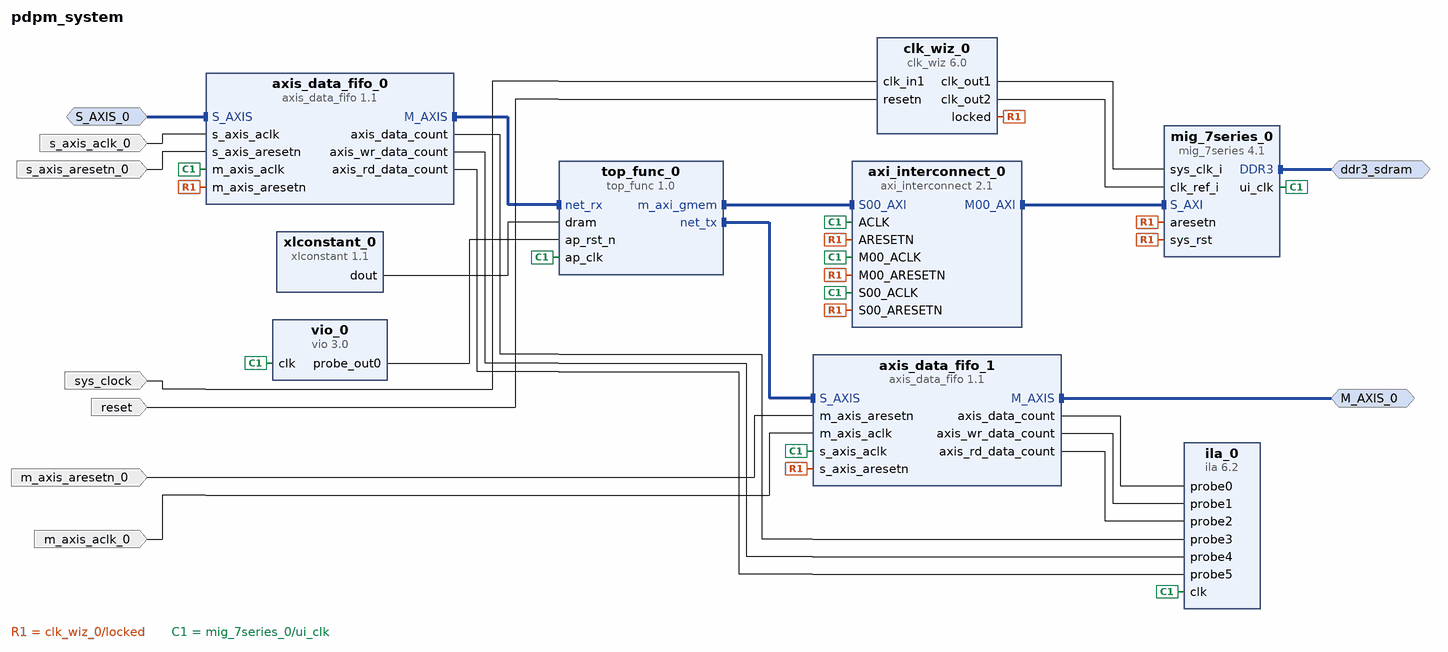
[diagram p0: block diagram of the top level]
# Vivado block design pdpm_system, xc7a100tcsg324-1, Vivado 2018.2.2
create_bd_design pdpm_system

create_bd_intf_port -mode Master -vlnv xilinx.com:interface:ddrx_rtl:1.0 ddr3_sdram
create_bd_intf_port -mode Master -vlnv xilinx.com:interface:axis_rtl:1.0 M_AXIS_0
create_bd_intf_port -mode Slave -vlnv xilinx.com:interface:axis_rtl:1.0 S_AXIS_0
set_property -dict [list \
  CONFIG.TDATA_NUM_BYTES 1 \
  CONFIG.TDEST_WIDTH 0 \
  CONFIG.TID_WIDTH 0 \
  CONFIG.TUSER_WIDTH 0 \
  CONFIG.HAS_TREADY 1 \
  CONFIG.HAS_TSTRB 0 \
  CONFIG.HAS_TKEEP 0 \
  CONFIG.HAS_TLAST 1 \
  CONFIG.LAYERED_METADATA undef \
] [get_bd_intf_ports S_AXIS_0]
create_bd_port -dir I -type clk sys_clock
set_property -dict {CONFIG.FREQ_HZ 100000000 CONFIG.PHASE 0.000} [get_bd_ports sys_clock]
create_bd_port -dir I -type rst reset
set_property -dict {CONFIG.POLARITY ACTIVE_LOW} [get_bd_ports reset]
create_bd_port -dir I -type clk s_axis_aclk_0
create_bd_port -dir I -type rst s_axis_aresetn_0
create_bd_port -dir I -type rst m_axis_aresetn_0
create_bd_port -dir I -type clk m_axis_aclk_0

create_bd_cell -type ip -vlnv xilinx.com:ip:mig_7series:4.1 mig_7series_0
set_property -dict {CONFIG.BOARD_MIG_PARAM ddr3_sdram} [get_bd_cells mig_7series_0]
create_bd_cell -type ip -vlnv xilinx.com:ip:clk_wiz:6.0 clk_wiz_0
set_property -dict [list \
  CONFIG.CLKOUT2_USED true \
  CONFIG.NUM_OUT_CLKS 2 \
  CONFIG.CLKOUT1_REQUESTED_OUT_FREQ 166.667 \
  CONFIG.CLKOUT2_REQUESTED_OUT_FREQ 200.000 \
  CONFIG.RESET_PORT resetn \
  CONFIG.MMCM_DIVCLK_DIVIDE 1 \
  CONFIG.MMCM_CLKOUT0_DIVIDE_F 6.000 \
  CONFIG.MMCM_CLKOUT1_DIVIDE 5 \
  CONFIG.RESET_TYPE ACTIVE_LOW \
  CONFIG.USE_BOARD_FLOW true \
  CONFIG.CLK_IN1_BOARD_INTERFACE Custom \
  CONFIG.RESET_BOARD_INTERFACE reset \
  CONFIG.CLKOUT1_JITTER 118.758 \
  CONFIG.CLKOUT2_JITTER 114.829 \
  CONFIG.CLKOUT2_PHASE_ERROR 98.575 \
] [get_bd_cells clk_wiz_0]
create_bd_cell -type ip -vlnv xilinx.com:ip:axi_interconnect:2.1 axi_interconnect_0
set_property -dict {CONFIG.NUM_SI 1 CONFIG.NUM_MI 1} [get_bd_cells axi_interconnect_0]
create_bd_cell -type ip -vlnv xilinx.com:ip:xlconstant:1.1 xlconstant_0
set_property -dict {CONFIG.CONST_WIDTH 32 CONFIG.CONST_VAL 0} [get_bd_cells xlconstant_0]
create_bd_cell -type ip -vlnv xilinx.com:ip:axis_data_fifo:1.1 axis_data_fifo_0
set_property -dict {CONFIG.IS_ACLK_ASYNC 1} [get_bd_cells axis_data_fifo_0]
create_bd_cell -type ip -vlnv xilinx.com:ip:axis_data_fifo:1.1 axis_data_fifo_1
set_property -dict {CONFIG.IS_ACLK_ASYNC 1} [get_bd_cells axis_data_fifo_1]
create_bd_cell -type ip -vlnv xilinx.com:ip:ila:6.2 ila_0
set_property -dict [list \
  CONFIG.C_PROBE5_WIDTH 32 \
  CONFIG.C_PROBE4_WIDTH 32 \
  CONFIG.C_PROBE3_WIDTH 32 \
  CONFIG.C_PROBE2_WIDTH 32 \
  CONFIG.C_PROBE1_WIDTH 32 \
  CONFIG.C_PROBE0_WIDTH 32 \
  CONFIG.C_NUM_OF_PROBES 6 \
  CONFIG.C_ENABLE_ILA_AXI_MON false \
  CONFIG.C_MONITOR_TYPE Native \
] [get_bd_cells ila_0]
create_bd_cell -type ip -vlnv xilinx.com:ip:vio:3.0 vio_0
set_property -dict {CONFIG.C_NUM_PROBE_OUT 1 CONFIG.C_NUM_PROBE_IN 0} [get_bd_cells vio_0]
create_bd_cell -type ip -vlnv xilinx.com:hls:top_func:1.0 top_func_0

# ---- connections ----

connect_bd_intf_net [get_bd_intf_pins axi_interconnect_0/M00_AXI] [get_bd_intf_pins mig_7series_0/S_AXI]
connect_bd_intf_net [get_bd_intf_pins top_func_0/m_axi_gmem] [get_bd_intf_pins axi_interconnect_0/S00_AXI]
connect_bd_intf_net [get_bd_intf_pins axis_data_fifo_0/M_AXIS] [get_bd_intf_pins top_func_0/net_rx]
connect_bd_intf_net [get_bd_intf_pins top_func_0/net_tx] [get_bd_intf_pins axis_data_fifo_1/S_AXIS]
connect_bd_intf_net [get_bd_intf_ports ddr3_sdram] [get_bd_intf_pins mig_7series_0/DDR3]
connect_bd_intf_net [get_bd_intf_ports M_AXIS_0] [get_bd_intf_pins axis_data_fifo_1/M_AXIS]
connect_bd_intf_net -intf_net S_AXIS_0_1 [get_bd_intf_ports S_AXIS_0] [get_bd_intf_pins axis_data_fifo_0/S_AXIS]
connect_bd_net [get_bd_ports sys_clock] [get_bd_pins clk_wiz_0/clk_in1]
connect_bd_net [get_bd_pins clk_wiz_0/clk_out1] [get_bd_pins mig_7series_0/sys_clk_i]
connect_bd_net [get_bd_pins clk_wiz_0/clk_out2] [get_bd_pins mig_7series_0/clk_ref_i]
connect_bd_net [get_bd_pins clk_wiz_0/locked] \
  [get_bd_pins mig_7series_0/sys_rst] [get_bd_pins mig_7series_0/aresetn] [get_bd_pins axis_data_fifo_1/s_axis_aresetn] \
  [get_bd_pins axi_interconnect_0/ARESETN] [get_bd_pins axi_interconnect_0/S00_ARESETN] \
  [get_bd_pins axi_interconnect_0/M00_ARESETN] [get_bd_pins axis_data_fifo_0/m_axis_aresetn]
connect_bd_net [get_bd_pins mig_7series_0/ui_clk] \
  [get_bd_pins axis_data_fifo_0/m_axis_aclk] [get_bd_pins axis_data_fifo_1/s_axis_aclk] [get_bd_pins axi_interconnect_0/ACLK] \
  [get_bd_pins axi_interconnect_0/S00_ACLK] [get_bd_pins axi_interconnect_0/M00_ACLK] [get_bd_pins ila_0/clk] \
  [get_bd_pins vio_0/clk] [get_bd_pins top_func_0/ap_clk]
connect_bd_net [get_bd_pins xlconstant_0/dout] [get_bd_pins top_func_0/dram]
connect_bd_net [get_bd_ports reset] [get_bd_pins clk_wiz_0/resetn]
connect_bd_net [get_bd_pins axis_data_fifo_1/axis_data_count] [get_bd_pins ila_0/probe0]
connect_bd_net [get_bd_pins axis_data_fifo_1/axis_wr_data_count] [get_bd_pins ila_0/probe1]
connect_bd_net [get_bd_pins axis_data_fifo_1/axis_rd_data_count] [get_bd_pins ila_0/probe2]
connect_bd_net -net s_axis_aclk_0_1 [get_bd_ports s_axis_aclk_0] [get_bd_pins axis_data_fifo_0/s_axis_aclk]
connect_bd_net -net s_axis_aresetn_0_1 [get_bd_ports s_axis_aresetn_0] [get_bd_pins axis_data_fifo_0/s_axis_aresetn]
connect_bd_net -net m_axis_aresetn_0_1 [get_bd_ports m_axis_aresetn_0] [get_bd_pins axis_data_fifo_1/m_axis_aresetn]
connect_bd_net -net m_axis_aclk_0_1 [get_bd_ports m_axis_aclk_0] [get_bd_pins axis_data_fifo_1/m_axis_aclk]
connect_bd_net [get_bd_pins axis_data_fifo_0/axis_data_count] [get_bd_pins ila_0/probe3]
connect_bd_net [get_bd_pins axis_data_fifo_0/axis_wr_data_count] [get_bd_pins ila_0/probe4]
connect_bd_net [get_bd_pins axis_data_fifo_0/axis_rd_data_count] [get_bd_pins ila_0/probe5]
connect_bd_net [get_bd_pins vio_0/probe_out0] [get_bd_pins top_func_0/ap_rst_n]

# ---- address map ----
assign_bd_address -offset 0x00000000 -range 256M -target_address_space [get_bd_addr_spaces top_func_0/Data_m_axi_gmem] [get_bd_addr_segs mig_7series_0/memmap/memaddr]

validate_bd_design
save_bd_design
